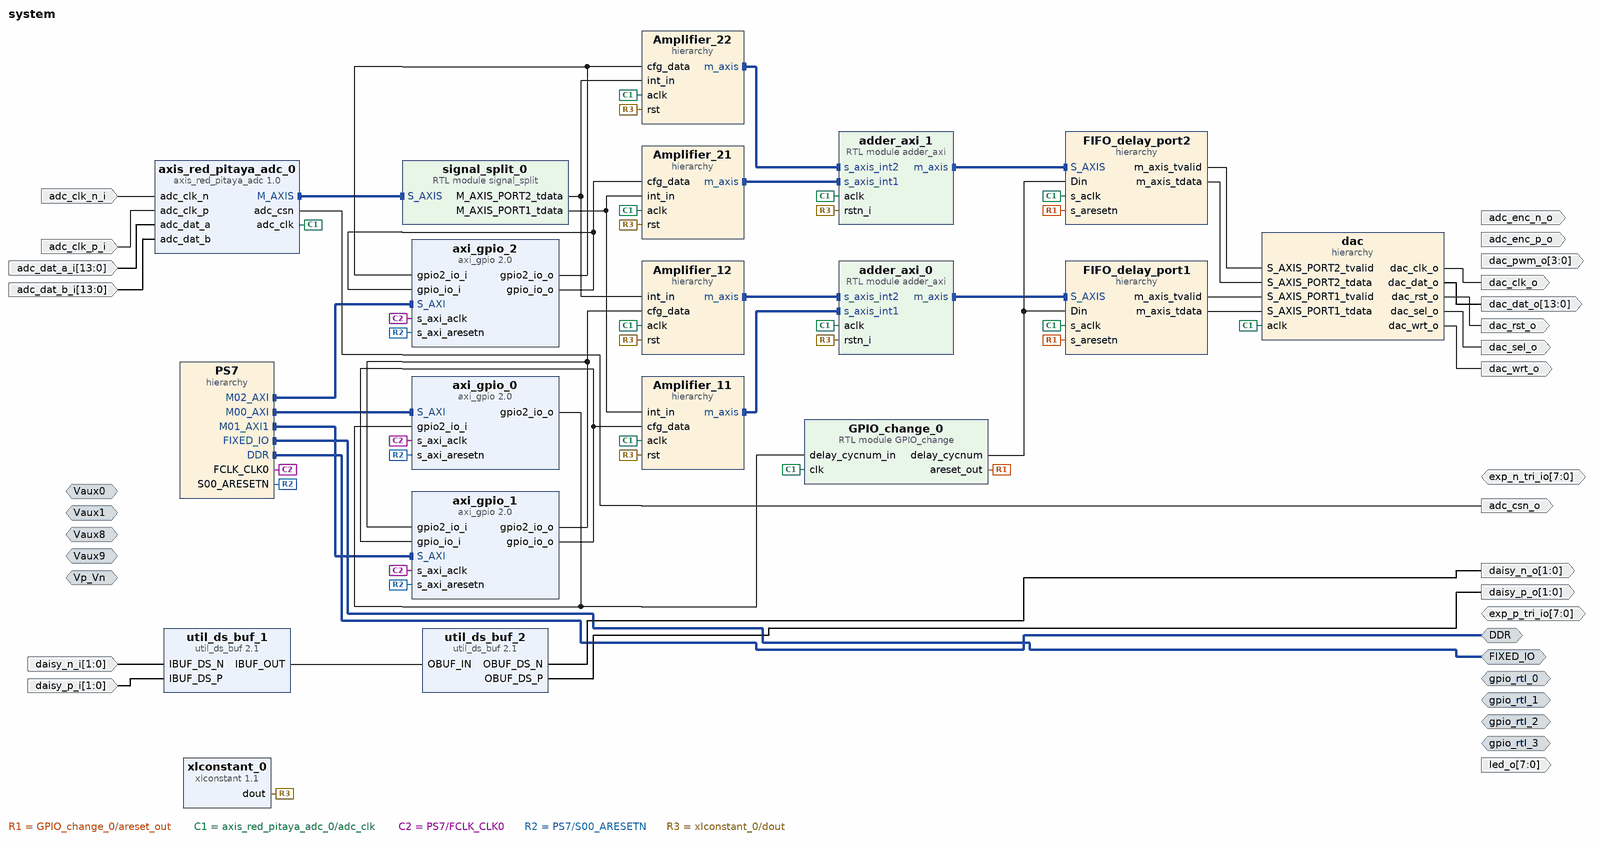
[diagram p0: block diagram of the top level]
# Vivado block design system, xc7z010clg400-1, Vivado 2020.1
create_bd_design system

create_bd_intf_port -mode Master -vlnv xilinx.com:interface:ddrx_rtl:1.0 DDR
create_bd_intf_port -mode Master -vlnv xilinx.com:display_processing_system7:fixedio_rtl:1.0 FIXED_IO
create_bd_intf_port -mode Slave -vlnv xilinx.com:interface:diff_analog_io_rtl:1.0 Vaux0
create_bd_intf_port -mode Slave -vlnv xilinx.com:interface:diff_analog_io_rtl:1.0 Vaux1
create_bd_intf_port -mode Slave -vlnv xilinx.com:interface:diff_analog_io_rtl:1.0 Vaux8
create_bd_intf_port -mode Slave -vlnv xilinx.com:interface:diff_analog_io_rtl:1.0 Vaux9
create_bd_intf_port -mode Slave -vlnv xilinx.com:interface:diff_analog_io_rtl:1.0 Vp_Vn
create_bd_intf_port -mode Master -vlnv xilinx.com:interface:gpio_rtl:1.0 gpio_rtl_0
create_bd_intf_port -mode Master -vlnv xilinx.com:interface:gpio_rtl:1.0 gpio_rtl_1
create_bd_intf_port -mode Master -vlnv xilinx.com:interface:gpio_rtl:1.0 gpio_rtl_2
create_bd_intf_port -mode Master -vlnv xilinx.com:interface:gpio_rtl:1.0 gpio_rtl_3
create_bd_port -dir I adc_clk_n_i
create_bd_port -dir I adc_clk_p_i
create_bd_port -dir O adc_csn_o
create_bd_port -dir I -from 13 -to 0 adc_dat_a_i
create_bd_port -dir I -from 13 -to 0 adc_dat_b_i
create_bd_port -dir O adc_enc_n_o
create_bd_port -dir O adc_enc_p_o
create_bd_port -dir O dac_clk_o
create_bd_port -dir O -from 13 -to 0 dac_dat_o
create_bd_port -dir O -from 3 -to 0 dac_pwm_o
create_bd_port -dir O dac_rst_o
create_bd_port -dir O dac_sel_o
create_bd_port -dir O dac_wrt_o
create_bd_port -dir I -from 1 -to 0 daisy_n_i
create_bd_port -dir O -from 1 -to 0 daisy_n_o
create_bd_port -dir I -from 1 -to 0 daisy_p_i
create_bd_port -dir O -from 1 -to 0 daisy_p_o
create_bd_port -dir IO -from 7 -to 0 exp_n_tri_io
create_bd_port -dir IO -from 7 -to 0 exp_p_tri_io
create_bd_port -dir O -from 7 -to 0 led_o

create_bd_cell -type hier FIFO_delay_port1
create_bd_cell -type hier FIFO_delay_port2
create_bd_cell -type module -reference GPIO_change GPIO_change_0
create_bd_cell -type hier PS7
create_bd_cell -type hier dac
create_bd_cell -type ip -vlnv xilinx.com:ip:util_ds_buf:2.1 util_ds_buf_1
set_property -dict {CONFIG.C_SIZE 2} [get_bd_cells util_ds_buf_1]
create_bd_cell -type ip -vlnv xilinx.com:ip:util_ds_buf:2.1 util_ds_buf_2
set_property -dict {CONFIG.C_BUF_TYPE OBUFDS CONFIG.C_SIZE 2} [get_bd_cells util_ds_buf_2]
create_bd_cell -type ip -vlnv pavel-demin:user:axis_red_pitaya_adc:1.0 axis_red_pitaya_adc_0
create_bd_cell -type module -reference signal_split signal_split_0
create_bd_cell -type hier Amplifier_11
create_bd_cell -type module -reference adder_axi adder_axi_0
create_bd_cell -type ip -vlnv xilinx.com:ip:xlconstant:1.1 xlconstant_0
create_bd_cell -type module -reference adder_axi adder_axi_1
create_bd_cell -type hier Amplifier_12
create_bd_cell -type hier Amplifier_21
create_bd_cell -type hier Amplifier_22
create_bd_cell -type ip -vlnv xilinx.com:ip:axi_gpio:2.0 axi_gpio_0
set_property -dict {CONFIG.C_ALL_INPUTS 1 CONFIG.C_ALL_INPUTS_2 0 CONFIG.C_IS_DUAL 1} [get_bd_cells axi_gpio_0]
create_bd_cell -type ip -vlnv xilinx.com:ip:axi_gpio:2.0 axi_gpio_1
set_property -dict {CONFIG.C_ALL_INPUTS 0 CONFIG.C_ALL_INPUTS_2 0 CONFIG.C_IS_DUAL 1} [get_bd_cells axi_gpio_1]
create_bd_cell -type ip -vlnv xilinx.com:ip:axi_gpio:2.0 axi_gpio_2
set_property -dict {CONFIG.C_ALL_INPUTS 0 CONFIG.C_ALL_INPUTS_2 0 CONFIG.C_IS_DUAL 1} [get_bd_cells axi_gpio_2]

# ---- hierarchy /FIFO_delay_port1 ----
current_bd_instance /FIFO_delay_port1
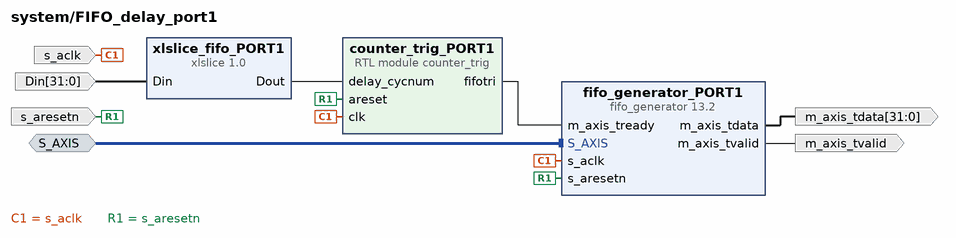
[diagram p1: block diagram inside /FIFO_delay_port1]
create_bd_intf_pin -mode Slave -vlnv xilinx.com:interface:axis_rtl:1.0 S_AXIS
create_bd_pin -dir I -from 31 -to 0 Din
create_bd_pin -dir O -from 31 -to 0 m_axis_tdata
create_bd_pin -dir O m_axis_tvalid
create_bd_pin -dir I -type clk s_aclk
create_bd_pin -dir I -type rst s_aresetn

create_bd_cell -type module -reference counter_trig counter_trig_PORT1
create_bd_cell -type ip -vlnv xilinx.com:ip:fifo_generator:13.2 fifo_generator_PORT1
set_property -dict [list \
  CONFIG.Clock_Type_AXI Common_Clock \
  CONFIG.Enable_Safety_Circuit true \
  CONFIG.FIFO_Implementation_rach Common_Clock_Distributed_RAM \
  CONFIG.FIFO_Implementation_wach Common_Clock_Distributed_RAM \
  CONFIG.FIFO_Implementation_wrch Common_Clock_Distributed_RAM \
  CONFIG.Full_Flags_Reset_Value 1 \
  CONFIG.INTERFACE_TYPE AXI_STREAM \
  CONFIG.Input_Depth_axis 16384 \
  CONFIG.TDATA_NUM_BYTES 4 \
  CONFIG.TUSER_WIDTH 0 \
] [get_bd_cells fifo_generator_PORT1]
create_bd_cell -type ip -vlnv xilinx.com:ip:xlslice:1.0 xlslice_fifo_PORT1
set_property -dict {CONFIG.DIN_FROM 15 CONFIG.DIN_TO 0 CONFIG.DOUT_WIDTH 16} [get_bd_cells xlslice_fifo_PORT1]

# ---- hierarchy /FIFO_delay_port2 ----
current_bd_instance /FIFO_delay_port2
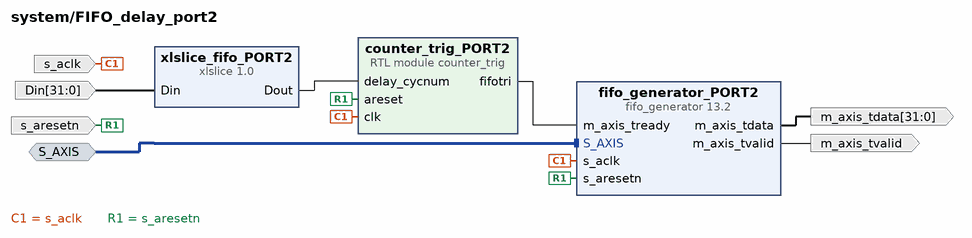
[diagram p2: block diagram inside /FIFO_delay_port2]
create_bd_intf_pin -mode Slave -vlnv xilinx.com:interface:axis_rtl:1.0 S_AXIS
create_bd_pin -dir I -from 31 -to 0 Din
create_bd_pin -dir O -from 31 -to 0 m_axis_tdata
create_bd_pin -dir O m_axis_tvalid
create_bd_pin -dir I -type clk s_aclk
create_bd_pin -dir I -type rst s_aresetn

create_bd_cell -type module -reference counter_trig counter_trig_PORT2
create_bd_cell -type ip -vlnv xilinx.com:ip:fifo_generator:13.2 fifo_generator_PORT2
set_property -dict [list \
  CONFIG.Enable_Safety_Circuit true \
  CONFIG.FIFO_Implementation_rach Common_Clock_Distributed_RAM \
  CONFIG.FIFO_Implementation_wach Common_Clock_Distributed_RAM \
  CONFIG.FIFO_Implementation_wrch Common_Clock_Distributed_RAM \
  CONFIG.Full_Flags_Reset_Value 1 \
  CONFIG.INTERFACE_TYPE AXI_STREAM \
  CONFIG.Input_Depth_axis 16384 \
  CONFIG.TDATA_NUM_BYTES 4 \
  CONFIG.TUSER_WIDTH 0 \
] [get_bd_cells fifo_generator_PORT2]
create_bd_cell -type ip -vlnv xilinx.com:ip:xlslice:1.0 xlslice_fifo_PORT2
set_property -dict {CONFIG.DIN_FROM 31 CONFIG.DIN_TO 16 CONFIG.DOUT_WIDTH 16} [get_bd_cells xlslice_fifo_PORT2]

# ---- hierarchy /PS7 ----
current_bd_instance /PS7
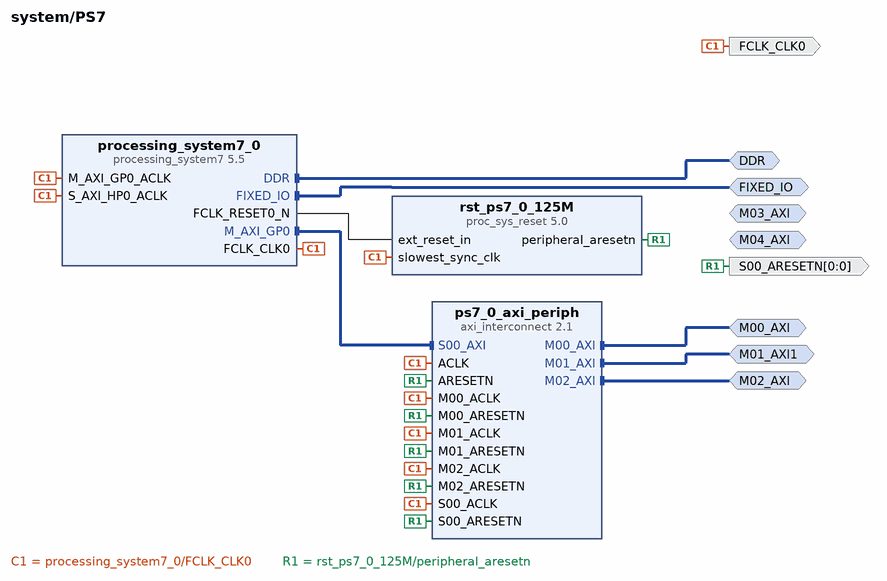
[diagram p3: block diagram inside /PS7]
create_bd_intf_pin -mode Master -vlnv xilinx.com:interface:ddrx_rtl:1.0 DDR
create_bd_intf_pin -mode Master -vlnv xilinx.com:display_processing_system7:fixedio_rtl:1.0 FIXED_IO
create_bd_intf_pin -mode Master -vlnv xilinx.com:interface:aximm_rtl:1.0 M00_AXI
create_bd_intf_pin -mode Master -vlnv xilinx.com:interface:aximm_rtl:1.0 M01_AXI1
create_bd_intf_pin -mode Master -vlnv xilinx.com:interface:aximm_rtl:1.0 M02_AXI
create_bd_intf_pin -mode Master -vlnv xilinx.com:interface:aximm_rtl:1.0 M03_AXI
create_bd_intf_pin -mode Master -vlnv xilinx.com:interface:aximm_rtl:1.0 M04_AXI
create_bd_pin -dir O -type clk FCLK_CLK0
create_bd_pin -dir O -from 0 -to 0 -type rst S00_ARESETN

create_bd_cell -type ip -vlnv xilinx.com:ip:processing_system7:5.5 processing_system7_0
set_property -dict [list \
  CONFIG.PCW_APU_PERIPHERAL_FREQMHZ 666.666666 \
  CONFIG.PCW_ENET0_ENET0_IO {MIO 16 .. 27} \
  CONFIG.PCW_ENET0_GRP_MDIO_ENABLE 1 \
  CONFIG.PCW_ENET0_GRP_MDIO_IO EMIO \
  CONFIG.PCW_ENET0_PERIPHERAL_ENABLE 1 \
  CONFIG.PCW_ENET0_RESET_ENABLE 0 \
  CONFIG.PCW_ENET_RESET_ENABLE 1 \
  CONFIG.PCW_ENET_RESET_SELECT {Share reset pin} \
  CONFIG.PCW_FPGA0_PERIPHERAL_FREQMHZ 125 \
  CONFIG.PCW_FPGA1_PERIPHERAL_FREQMHZ 250 \
  CONFIG.PCW_FPGA3_PERIPHERAL_FREQMHZ 200 \
  CONFIG.PCW_GPIO_MIO_GPIO_ENABLE 1 \
  CONFIG.PCW_GPIO_MIO_GPIO_IO MIO \
  CONFIG.PCW_GPIO_PERIPHERAL_ENABLE 1 \
  CONFIG.PCW_I2C0_GRP_INT_ENABLE 0 \
  CONFIG.PCW_I2C0_I2C0_IO {MIO 50 .. 51} \
  CONFIG.PCW_I2C0_PERIPHERAL_ENABLE 1 \
  CONFIG.PCW_I2C_PERIPHERAL_FREQMHZ 111.111115 \
  CONFIG.PCW_I2C_RESET_ENABLE 1 \
  CONFIG.PCW_I2C_RESET_SELECT {Share reset pin} \
  CONFIG.PCW_IMPORT_BOARD_PRESET cfg/red_pitaya.xml \
  CONFIG.PCW_PRESET_BANK1_VOLTAGE {LVCMOS 2.5V} \
  CONFIG.PCW_QSPI_GRP_SINGLE_SS_ENABLE 1 \
  CONFIG.PCW_QSPI_GRP_SINGLE_SS_IO {MIO 1 .. 6} \
  CONFIG.PCW_QSPI_PERIPHERAL_ENABLE 1 \
  CONFIG.PCW_QSPI_PERIPHERAL_FREQMHZ 125 \
  CONFIG.PCW_QSPI_QSPI_IO {MIO 1 .. 6} \
  CONFIG.PCW_SD0_GRP_CD_ENABLE 1 \
  CONFIG.PCW_SD0_GRP_CD_IO {MIO 46} \
  CONFIG.PCW_SD0_GRP_WP_ENABLE 1 \
  CONFIG.PCW_SD0_GRP_WP_IO {MIO 47} \
  CONFIG.PCW_SD0_PERIPHERAL_ENABLE 1 \
  CONFIG.PCW_SD0_SD0_IO {MIO 40 .. 45} \
  CONFIG.PCW_SDIO_PERIPHERAL_FREQMHZ 100 \
  CONFIG.PCW_SINGLE_QSPI_DATA_MODE x4 \
  CONFIG.PCW_SPI0_PERIPHERAL_ENABLE 1 \
  CONFIG.PCW_SPI0_SPI0_IO EMIO \
  CONFIG.PCW_SPI1_PERIPHERAL_ENABLE 1 \
  CONFIG.PCW_SPI1_SPI1_IO {MIO 10 .. 15} \
  CONFIG.PCW_TTC0_PERIPHERAL_ENABLE 1 \
  CONFIG.PCW_TTC0_TTC0_IO EMIO \
  CONFIG.PCW_UART0_PERIPHERAL_ENABLE 1 \
  CONFIG.PCW_UART0_UART0_IO {MIO 14 .. 15} \
  CONFIG.PCW_UART1_PERIPHERAL_ENABLE 1 \
  CONFIG.PCW_UART1_UART1_IO {MIO 8 .. 9} \
  CONFIG.PCW_UART_PERIPHERAL_FREQMHZ 100 \
  CONFIG.PCW_UIPARAM_DDR_BUS_WIDTH {16 Bit} \
  CONFIG.PCW_UIPARAM_DDR_FREQ_MHZ 533.333333 \
  CONFIG.PCW_UIPARAM_DDR_PARTNO {MT41J256M16 RE-125} \
  CONFIG.PCW_USB0_PERIPHERAL_ENABLE 1 \
  CONFIG.PCW_USB0_RESET_ENABLE 1 \
  CONFIG.PCW_USB0_RESET_IO {MIO 48} \
  CONFIG.PCW_USB0_USB0_IO {MIO 28 .. 39} \
  CONFIG.PCW_USB_RESET_ENABLE 1 \
  CONFIG.PCW_USB_RESET_SELECT {Share reset pin} \
  CONFIG.PCW_USE_S_AXI_HP0 1 \
] [get_bd_cells processing_system7_0]
# 429 more settings of processing_system7_0 are not shown: defaults, MIO pin electricals, DDR timing, and values the tool derives
create_bd_cell -type ip -vlnv xilinx.com:ip:axi_interconnect:2.1 ps7_0_axi_periph
set_property -dict {CONFIG.NUM_MI 3 CONFIG.NUM_SI 1 CONFIG.S00_HAS_DATA_FIFO 2 CONFIG.STRATEGY 0} [get_bd_cells ps7_0_axi_periph]
create_bd_cell -type ip -vlnv xilinx.com:ip:proc_sys_reset:5.0 rst_ps7_0_125M

# ---- hierarchy /dac ----
current_bd_instance /dac
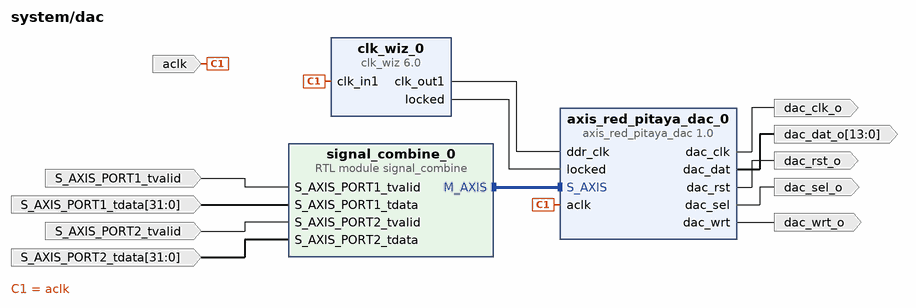
[diagram p4: block diagram inside /dac]
create_bd_pin -dir I -type clk aclk
create_bd_pin -dir O -type clk dac_clk_o
create_bd_pin -dir O -from 13 -to 0 dac_dat_o
create_bd_pin -dir O -type rst dac_rst_o
create_bd_pin -dir O dac_sel_o
create_bd_pin -dir O dac_wrt_o
create_bd_pin -dir I S_AXIS_PORT1_tvalid
create_bd_pin -dir I -from 31 -to 0 S_AXIS_PORT1_tdata
create_bd_pin -dir I S_AXIS_PORT2_tvalid
create_bd_pin -dir I -from 31 -to 0 S_AXIS_PORT2_tdata

create_bd_cell -type ip -vlnv pavel-demin:user:axis_red_pitaya_dac:1.0 axis_red_pitaya_dac_0
create_bd_cell -type ip -vlnv xilinx.com:ip:clk_wiz:6.0 clk_wiz_0
set_property -dict [list \
  CONFIG.CLKIN1_JITTER_PS 80.0 \
  CONFIG.CLKOUT1_JITTER 104.759 \
  CONFIG.CLKOUT1_PHASE_ERROR 96.948 \
  CONFIG.CLKOUT1_REQUESTED_OUT_FREQ 250.000 \
  CONFIG.MMCM_CLKFBOUT_MULT_F 8.000 \
  CONFIG.MMCM_CLKIN1_PERIOD 8.000 \
  CONFIG.MMCM_CLKOUT0_DIVIDE_F 4.000 \
  CONFIG.MMCM_DIVCLK_DIVIDE 1 \
  CONFIG.PRIM_IN_FREQ 125.000 \
  CONFIG.USE_RESET false \
] [get_bd_cells clk_wiz_0]
create_bd_cell -type module -reference signal_combine signal_combine_0

# ---- hierarchy /Amplifier_11 ----
current_bd_instance /Amplifier_11
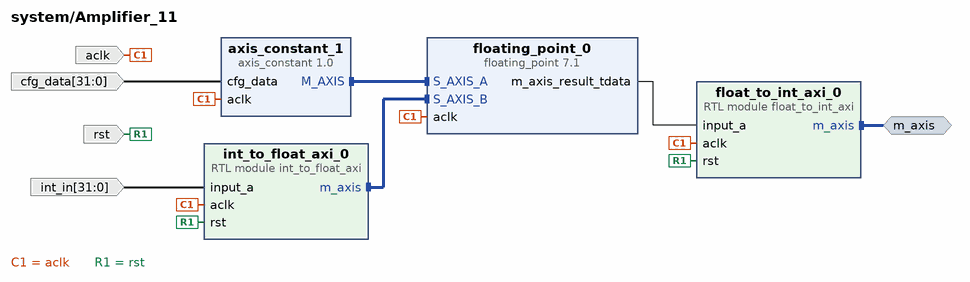
[diagram p5: block diagram inside /Amplifier_11]
create_bd_intf_pin -mode Master -vlnv xilinx.com:interface:axis_rtl:1.0 m_axis
create_bd_pin -dir I -type clk aclk
create_bd_pin -dir I -from 31 -to 0 cfg_data
create_bd_pin -dir I -from 31 -to 0 int_in
create_bd_pin -dir I -type rst rst

create_bd_cell -type ip -vlnv pavel-demin:user:axis_constant:1.0 axis_constant_1
create_bd_cell -type ip -vlnv xilinx.com:ip:floating_point:7.1 floating_point_0
set_property -dict [list \
  CONFIG.C_Latency 8 \
  CONFIG.C_Mult_Usage Full_Usage \
  CONFIG.C_Rate 1 \
  CONFIG.C_Result_Exponent_Width 8 \
  CONFIG.C_Result_Fraction_Width 24 \
  CONFIG.Flow_Control NonBlocking \
  CONFIG.Has_RESULT_TREADY false \
  CONFIG.Operation_Type Multiply \
  CONFIG.Result_Precision_Type Single \
] [get_bd_cells floating_point_0]
create_bd_cell -type module -reference float_to_int_axi float_to_int_axi_0
create_bd_cell -type module -reference int_to_float_axi int_to_float_axi_0

# ---- hierarchy /Amplifier_12 ----
current_bd_instance /Amplifier_12
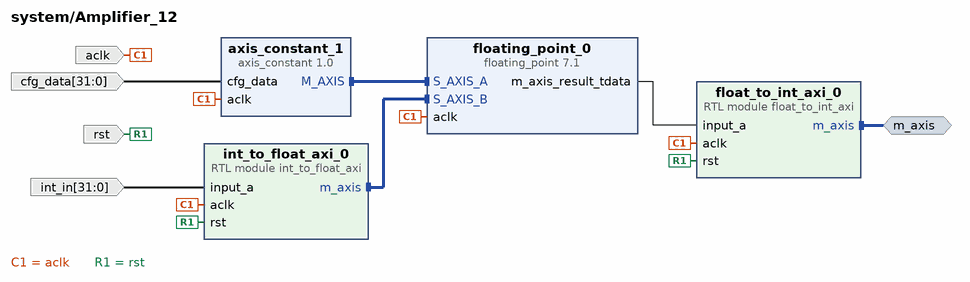
[diagram p6: block diagram inside /Amplifier_12]
create_bd_intf_pin -mode Master -vlnv xilinx.com:interface:axis_rtl:1.0 m_axis
create_bd_pin -dir I -type clk aclk
create_bd_pin -dir I -from 31 -to 0 cfg_data
create_bd_pin -dir I -from 31 -to 0 int_in
create_bd_pin -dir I -type rst rst

create_bd_cell -type ip -vlnv pavel-demin:user:axis_constant:1.0 axis_constant_1
create_bd_cell -type ip -vlnv xilinx.com:ip:floating_point:7.1 floating_point_0
set_property -dict [list \
  CONFIG.C_Latency 8 \
  CONFIG.C_Mult_Usage Full_Usage \
  CONFIG.C_Rate 1 \
  CONFIG.C_Result_Exponent_Width 8 \
  CONFIG.C_Result_Fraction_Width 24 \
  CONFIG.Flow_Control NonBlocking \
  CONFIG.Has_RESULT_TREADY false \
  CONFIG.Operation_Type Multiply \
  CONFIG.Result_Precision_Type Single \
] [get_bd_cells floating_point_0]
create_bd_cell -type module -reference float_to_int_axi float_to_int_axi_0
create_bd_cell -type module -reference int_to_float_axi int_to_float_axi_0

# ---- hierarchy /Amplifier_21 ----
current_bd_instance /Amplifier_21
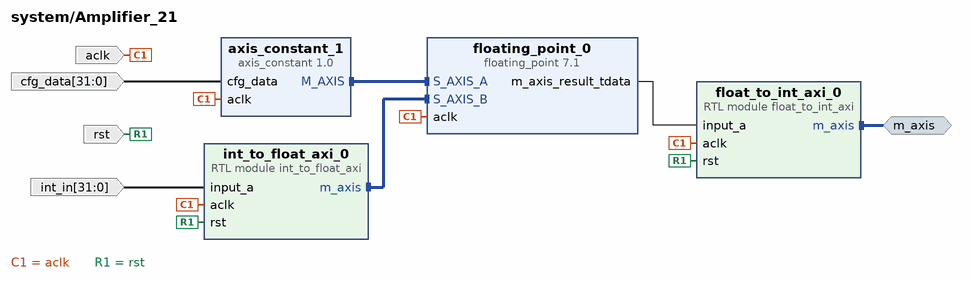
[diagram p7: block diagram inside /Amplifier_21]
create_bd_intf_pin -mode Master -vlnv xilinx.com:interface:axis_rtl:1.0 m_axis
create_bd_pin -dir I -type clk aclk
create_bd_pin -dir I -from 31 -to 0 cfg_data
create_bd_pin -dir I -from 31 -to 0 int_in
create_bd_pin -dir I -type rst rst

create_bd_cell -type ip -vlnv pavel-demin:user:axis_constant:1.0 axis_constant_1
create_bd_cell -type ip -vlnv xilinx.com:ip:floating_point:7.1 floating_point_0
set_property -dict [list \
  CONFIG.C_Latency 8 \
  CONFIG.C_Mult_Usage Full_Usage \
  CONFIG.C_Rate 1 \
  CONFIG.C_Result_Exponent_Width 8 \
  CONFIG.C_Result_Fraction_Width 24 \
  CONFIG.Flow_Control NonBlocking \
  CONFIG.Has_RESULT_TREADY false \
  CONFIG.Operation_Type Multiply \
  CONFIG.Result_Precision_Type Single \
] [get_bd_cells floating_point_0]
create_bd_cell -type module -reference float_to_int_axi float_to_int_axi_0
create_bd_cell -type module -reference int_to_float_axi int_to_float_axi_0

# ---- hierarchy /Amplifier_22 ----
current_bd_instance /Amplifier_22
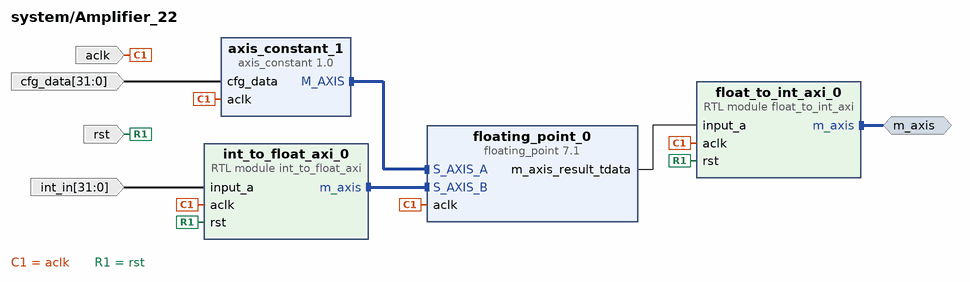
[diagram p8: block diagram inside /Amplifier_22]
create_bd_intf_pin -mode Master -vlnv xilinx.com:interface:axis_rtl:1.0 m_axis
create_bd_pin -dir I -type clk aclk
create_bd_pin -dir I -from 31 -to 0 cfg_data
create_bd_pin -dir I -from 31 -to 0 int_in
create_bd_pin -dir I -type rst rst

create_bd_cell -type ip -vlnv pavel-demin:user:axis_constant:1.0 axis_constant_1
create_bd_cell -type ip -vlnv xilinx.com:ip:floating_point:7.1 floating_point_0
set_property -dict [list \
  CONFIG.C_Latency 8 \
  CONFIG.C_Mult_Usage Full_Usage \
  CONFIG.C_Rate 1 \
  CONFIG.C_Result_Exponent_Width 8 \
  CONFIG.C_Result_Fraction_Width 24 \
  CONFIG.Flow_Control NonBlocking \
  CONFIG.Has_RESULT_TREADY false \
  CONFIG.Operation_Type Multiply \
  CONFIG.Result_Precision_Type Single \
] [get_bd_cells floating_point_0]
create_bd_cell -type module -reference float_to_int_axi float_to_int_axi_0
create_bd_cell -type module -reference int_to_float_axi int_to_float_axi_0

# ---- connections ----

current_bd_instance /FIFO_delay_port1
connect_bd_intf_net [get_bd_intf_pins S_AXIS] [get_bd_intf_pins fifo_generator_PORT1/S_AXIS]
connect_bd_net [get_bd_pins Din] [get_bd_pins xlslice_fifo_PORT1/Din]
connect_bd_net [get_bd_pins counter_trig_PORT1/fifotri] [get_bd_pins fifo_generator_PORT1/m_axis_tready]
connect_bd_net [get_bd_pins fifo_generator_PORT1/m_axis_tdata] [get_bd_pins m_axis_tdata]
connect_bd_net [get_bd_pins fifo_generator_PORT1/m_axis_tvalid] [get_bd_pins m_axis_tvalid]
connect_bd_net [get_bd_pins s_aclk] [get_bd_pins counter_trig_PORT1/clk] [get_bd_pins fifo_generator_PORT1/s_aclk]
connect_bd_net [get_bd_pins s_aresetn] [get_bd_pins counter_trig_PORT1/areset] [get_bd_pins fifo_generator_PORT1/s_aresetn]
connect_bd_net [get_bd_pins xlslice_fifo_PORT1/Dout] [get_bd_pins counter_trig_PORT1/delay_cycnum]

current_bd_instance /FIFO_delay_port2
connect_bd_intf_net -intf_net signal_split_0_M_AXIS_PORT2 [get_bd_intf_pins S_AXIS] [get_bd_intf_pins fifo_generator_PORT2/S_AXIS]
connect_bd_net [get_bd_pins Din] [get_bd_pins xlslice_fifo_PORT2/Din]
connect_bd_net -net axis_red_pitaya_adc_0_adc_clk [get_bd_pins s_aclk] [get_bd_pins counter_trig_PORT2/clk] [get_bd_pins fifo_generator_PORT2/s_aclk]
connect_bd_net -net counter_trig_0_fifotri [get_bd_pins counter_trig_PORT2/fifotri] [get_bd_pins fifo_generator_PORT2/m_axis_tready]
connect_bd_net -net delay_sync_0_areset_out [get_bd_pins s_aresetn] \
  [get_bd_pins counter_trig_PORT2/areset] [get_bd_pins fifo_generator_PORT2/s_aresetn]
connect_bd_net -net fifo_generator_0_m_axis_tdata [get_bd_pins fifo_generator_PORT2/m_axis_tdata] [get_bd_pins m_axis_tdata]
connect_bd_net -net fifo_generator_0_m_axis_tvalid [get_bd_pins fifo_generator_PORT2/m_axis_tvalid] [get_bd_pins m_axis_tvalid]
connect_bd_net [get_bd_pins xlslice_fifo_PORT2/Dout] [get_bd_pins counter_trig_PORT2/delay_cycnum]

current_bd_instance /PS7
connect_bd_intf_net [get_bd_intf_pins M01_AXI1] [get_bd_intf_pins ps7_0_axi_periph/M01_AXI]
connect_bd_intf_net [get_bd_intf_pins M00_AXI] [get_bd_intf_pins ps7_0_axi_periph/M00_AXI]
connect_bd_intf_net [get_bd_intf_pins M02_AXI] [get_bd_intf_pins ps7_0_axi_periph/M02_AXI]
connect_bd_intf_net [get_bd_intf_pins FIXED_IO] [get_bd_intf_pins processing_system7_0/FIXED_IO]
connect_bd_intf_net [get_bd_intf_pins processing_system7_0/M_AXI_GP0] [get_bd_intf_pins ps7_0_axi_periph/S00_AXI]
connect_bd_intf_net [get_bd_intf_pins DDR] [get_bd_intf_pins processing_system7_0/DDR]
connect_bd_net [get_bd_pins processing_system7_0/FCLK_CLK0] \
  [get_bd_pins FCLK_CLK0] [get_bd_pins processing_system7_0/M_AXI_GP0_ACLK] [get_bd_pins processing_system7_0/S_AXI_HP0_ACLK] \
  [get_bd_pins ps7_0_axi_periph/ACLK] [get_bd_pins ps7_0_axi_periph/M00_ACLK] [get_bd_pins ps7_0_axi_periph/M01_ACLK] \
  [get_bd_pins ps7_0_axi_periph/S00_ACLK] [get_bd_pins rst_ps7_0_125M/slowest_sync_clk] \
  [get_bd_pins ps7_0_axi_periph/M02_ACLK]
connect_bd_net [get_bd_pins processing_system7_0/FCLK_RESET0_N] [get_bd_pins rst_ps7_0_125M/ext_reset_in]
connect_bd_net [get_bd_pins rst_ps7_0_125M/peripheral_aresetn] \
  [get_bd_pins S00_ARESETN] [get_bd_pins ps7_0_axi_periph/ARESETN] [get_bd_pins ps7_0_axi_periph/M00_ARESETN] \
  [get_bd_pins ps7_0_axi_periph/M01_ARESETN] [get_bd_pins ps7_0_axi_periph/S00_ARESETN] \
  [get_bd_pins ps7_0_axi_periph/M02_ARESETN]

current_bd_instance /dac
connect_bd_intf_net [get_bd_intf_pins axis_red_pitaya_dac_0/S_AXIS] [get_bd_intf_pins signal_combine_0/M_AXIS]
connect_bd_net -net axis_red_pitaya_adc_0_adc_clk [get_bd_pins aclk] [get_bd_pins axis_red_pitaya_dac_0/aclk] [get_bd_pins clk_wiz_0/clk_in1]
connect_bd_net [get_bd_pins axis_red_pitaya_dac_0/dac_clk] [get_bd_pins dac_clk_o]
connect_bd_net [get_bd_pins axis_red_pitaya_dac_0/dac_dat] [get_bd_pins dac_dat_o]
connect_bd_net [get_bd_pins axis_red_pitaya_dac_0/dac_rst] [get_bd_pins dac_rst_o]
connect_bd_net [get_bd_pins axis_red_pitaya_dac_0/dac_sel] [get_bd_pins dac_sel_o]
connect_bd_net [get_bd_pins axis_red_pitaya_dac_0/dac_wrt] [get_bd_pins dac_wrt_o]
connect_bd_net [get_bd_pins clk_wiz_0/clk_out1] [get_bd_pins axis_red_pitaya_dac_0/ddr_clk]
connect_bd_net [get_bd_pins clk_wiz_0/locked] [get_bd_pins axis_red_pitaya_dac_0/locked]
connect_bd_net [get_bd_pins S_AXIS_PORT1_tvalid] [get_bd_pins signal_combine_0/S_AXIS_PORT1_tvalid]
connect_bd_net [get_bd_pins S_AXIS_PORT1_tdata] [get_bd_pins signal_combine_0/S_AXIS_PORT1_tdata]
connect_bd_net [get_bd_pins S_AXIS_PORT2_tvalid] [get_bd_pins signal_combine_0/S_AXIS_PORT2_tvalid]
connect_bd_net [get_bd_pins S_AXIS_PORT2_tdata] [get_bd_pins signal_combine_0/S_AXIS_PORT2_tdata]

current_bd_instance /Amplifier_11
connect_bd_intf_net [get_bd_intf_pins axis_constant_1/M_AXIS] [get_bd_intf_pins floating_point_0/S_AXIS_A]
connect_bd_intf_net [get_bd_intf_pins m_axis] [get_bd_intf_pins float_to_int_axi_0/m_axis]
connect_bd_intf_net [get_bd_intf_pins int_to_float_axi_0/m_axis] [get_bd_intf_pins floating_point_0/S_AXIS_B]
connect_bd_net -net axis_red_pitaya_adc_0_adc_clk [get_bd_pins aclk] \
  [get_bd_pins floating_point_0/aclk] [get_bd_pins axis_constant_1/aclk] [get_bd_pins float_to_int_axi_0/aclk] \
  [get_bd_pins int_to_float_axi_0/aclk]
connect_bd_net -net axi_gpio_1_gpio2_io_o [get_bd_pins cfg_data] [get_bd_pins axis_constant_1/cfg_data]
connect_bd_net -net signal_split_0_M_AXIS_PORT1_tdata [get_bd_pins int_in] [get_bd_pins int_to_float_axi_0/input_a]
connect_bd_net [get_bd_pins floating_point_0/m_axis_result_tdata] [get_bd_pins float_to_int_axi_0/input_a]
connect_bd_net [get_bd_pins rst] [get_bd_pins int_to_float_axi_0/rst] [get_bd_pins float_to_int_axi_0/rst]

current_bd_instance /Amplifier_12
connect_bd_intf_net [get_bd_intf_pins axis_constant_1/M_AXIS] [get_bd_intf_pins floating_point_0/S_AXIS_A]
connect_bd_intf_net [get_bd_intf_pins int_to_float_axi_0/m_axis] [get_bd_intf_pins floating_point_0/S_AXIS_B]
connect_bd_intf_net [get_bd_intf_pins m_axis] [get_bd_intf_pins float_to_int_axi_0/m_axis]
connect_bd_net -net axis_red_pitaya_adc_0_adc_clk [get_bd_pins aclk] \
  [get_bd_pins floating_point_0/aclk] [get_bd_pins axis_constant_1/aclk] [get_bd_pins float_to_int_axi_0/aclk] \
  [get_bd_pins int_to_float_axi_0/aclk]
connect_bd_net -net axi_gpio_1_gpio2_io_o [get_bd_pins cfg_data] [get_bd_pins axis_constant_1/cfg_data]
connect_bd_net -net signal_split_0_M_AXIS_PORT1_tdata [get_bd_pins int_in] [get_bd_pins int_to_float_axi_0/input_a]
connect_bd_net [get_bd_pins floating_point_0/m_axis_result_tdata] [get_bd_pins float_to_int_axi_0/input_a]
connect_bd_net [get_bd_pins rst] [get_bd_pins int_to_float_axi_0/rst] [get_bd_pins float_to_int_axi_0/rst]

current_bd_instance /Amplifier_21
connect_bd_intf_net [get_bd_intf_pins m_axis] [get_bd_intf_pins float_to_int_axi_0/m_axis]
connect_bd_intf_net [get_bd_intf_pins axis_constant_1/M_AXIS] [get_bd_intf_pins floating_point_0/S_AXIS_A]
connect_bd_intf_net [get_bd_intf_pins int_to_float_axi_0/m_axis] [get_bd_intf_pins floating_point_0/S_AXIS_B]
connect_bd_net -net axis_red_pitaya_adc_0_adc_clk [get_bd_pins aclk] \
  [get_bd_pins floating_point_0/aclk] [get_bd_pins axis_constant_1/aclk] [get_bd_pins float_to_int_axi_0/aclk] \
  [get_bd_pins int_to_float_axi_0/aclk]
connect_bd_net -net axi_gpio_1_gpio2_io_o [get_bd_pins cfg_data] [get_bd_pins axis_constant_1/cfg_data]
connect_bd_net -net signal_split_0_M_AXIS_PORT1_tdata [get_bd_pins int_in] [get_bd_pins int_to_float_axi_0/input_a]
connect_bd_net [get_bd_pins floating_point_0/m_axis_result_tdata] [get_bd_pins float_to_int_axi_0/input_a]
connect_bd_net [get_bd_pins rst] [get_bd_pins int_to_float_axi_0/rst] [get_bd_pins float_to_int_axi_0/rst]

current_bd_instance /Amplifier_22
connect_bd_intf_net [get_bd_intf_pins int_to_float_axi_0/m_axis] [get_bd_intf_pins floating_point_0/S_AXIS_B]
connect_bd_intf_net [get_bd_intf_pins m_axis] [get_bd_intf_pins float_to_int_axi_0/m_axis]
connect_bd_intf_net [get_bd_intf_pins axis_constant_1/M_AXIS] [get_bd_intf_pins floating_point_0/S_AXIS_A]
connect_bd_net -net axis_red_pitaya_adc_0_adc_clk [get_bd_pins aclk] \
  [get_bd_pins floating_point_0/aclk] [get_bd_pins axis_constant_1/aclk] [get_bd_pins float_to_int_axi_0/aclk] \
  [get_bd_pins int_to_float_axi_0/aclk]
connect_bd_net -net axi_gpio_1_gpio2_io_o [get_bd_pins cfg_data] [get_bd_pins axis_constant_1/cfg_data]
connect_bd_net -net signal_split_0_M_AXIS_PORT1_tdata [get_bd_pins int_in] [get_bd_pins int_to_float_axi_0/input_a]
connect_bd_net [get_bd_pins floating_point_0/m_axis_result_tdata] [get_bd_pins float_to_int_axi_0/input_a]
connect_bd_net [get_bd_pins rst] [get_bd_pins int_to_float_axi_0/rst] [get_bd_pins float_to_int_axi_0/rst]

current_bd_instance /
connect_bd_intf_net -intf_net processing_system7_0_FIXED_IO [get_bd_intf_ports FIXED_IO] [get_bd_intf_pins PS7/FIXED_IO]
connect_bd_intf_net [get_bd_intf_pins Amplifier_11/m_axis] [get_bd_intf_pins adder_axi_0/s_axis_int1]
connect_bd_intf_net [get_bd_intf_pins PS7/M01_AXI1] [get_bd_intf_pins axi_gpio_1/S_AXI]
connect_bd_intf_net [get_bd_intf_pins adder_axi_1/m_axis] [get_bd_intf_pins FIFO_delay_port2/S_AXIS]
connect_bd_intf_net [get_bd_intf_pins Amplifier_21/m_axis] [get_bd_intf_pins adder_axi_1/s_axis_int1]
connect_bd_intf_net [get_bd_intf_pins PS7/M02_AXI] [get_bd_intf_pins axi_gpio_2/S_AXI]
connect_bd_intf_net [get_bd_intf_pins axis_red_pitaya_adc_0/M_AXIS] [get_bd_intf_pins signal_split_0/S_AXIS]
connect_bd_intf_net [get_bd_intf_pins Amplifier_22/m_axis] [get_bd_intf_pins adder_axi_1/s_axis_int2]
connect_bd_intf_net [get_bd_intf_pins adder_axi_0/m_axis] [get_bd_intf_pins FIFO_delay_port1/S_AXIS]
connect_bd_intf_net [get_bd_intf_pins Amplifier_12/m_axis] [get_bd_intf_pins adder_axi_0/s_axis_int2]
connect_bd_intf_net -intf_net processing_system7_0_DDR [get_bd_intf_ports DDR] [get_bd_intf_pins PS7/DDR]
connect_bd_intf_net [get_bd_intf_pins PS7/M00_AXI] [get_bd_intf_pins axi_gpio_0/S_AXI]
connect_bd_net [get_bd_pins GPIO_change_0/areset_out] [get_bd_pins FIFO_delay_port1/s_aresetn] [get_bd_pins FIFO_delay_port2/s_aresetn]
connect_bd_net [get_bd_pins GPIO_change_0/delay_cycnum] [get_bd_pins FIFO_delay_port1/Din] [get_bd_pins FIFO_delay_port2/Din]
connect_bd_net [get_bd_ports adc_clk_n_i] [get_bd_pins axis_red_pitaya_adc_0/adc_clk_n]
connect_bd_net [get_bd_ports adc_clk_p_i] [get_bd_pins axis_red_pitaya_adc_0/adc_clk_p]
connect_bd_net [get_bd_ports adc_dat_a_i] [get_bd_pins axis_red_pitaya_adc_0/adc_dat_a]
connect_bd_net [get_bd_ports adc_dat_b_i] [get_bd_pins axis_red_pitaya_adc_0/adc_dat_b]
connect_bd_net [get_bd_pins axi_gpio_0/gpio2_io_o] [get_bd_pins GPIO_change_0/delay_cycnum_in] [get_bd_pins axi_gpio_0/gpio2_io_i]
connect_bd_net [get_bd_pins axis_red_pitaya_adc_0/adc_clk] \
  [get_bd_pins FIFO_delay_port1/s_aclk] [get_bd_pins FIFO_delay_port2/s_aclk] [get_bd_pins GPIO_change_0/clk] \
  [get_bd_pins dac/aclk] [get_bd_pins Amplifier_11/aclk] [get_bd_pins adder_axi_0/aclk] [get_bd_pins adder_axi_1/aclk] \
  [get_bd_pins Amplifier_12/aclk] [get_bd_pins Amplifier_21/aclk] [get_bd_pins Amplifier_22/aclk]
connect_bd_net [get_bd_pins axis_red_pitaya_adc_0/adc_csn] [get_bd_ports adc_csn_o]
connect_bd_net -net axis_red_pitaya_dac_0_dac_clk [get_bd_pins dac/dac_clk_o] [get_bd_ports dac_clk_o]
connect_bd_net -net axis_red_pitaya_dac_0_dac_dat [get_bd_pins dac/dac_dat_o] [get_bd_ports dac_dat_o]
connect_bd_net -net axis_red_pitaya_dac_0_dac_rst [get_bd_pins dac/dac_rst_o] [get_bd_ports dac_rst_o]
connect_bd_net -net axis_red_pitaya_dac_0_dac_sel [get_bd_pins dac/dac_sel_o] [get_bd_ports dac_sel_o]
connect_bd_net -net axis_red_pitaya_dac_0_dac_wrt [get_bd_pins dac/dac_wrt_o] [get_bd_ports dac_wrt_o]
connect_bd_net [get_bd_ports daisy_n_i] [get_bd_pins util_ds_buf_1/IBUF_DS_N]
connect_bd_net [get_bd_ports daisy_p_i] [get_bd_pins util_ds_buf_1/IBUF_DS_P]
connect_bd_net -net processing_system7_0_FCLK_CLK0 [get_bd_pins PS7/FCLK_CLK0] \
  [get_bd_pins axi_gpio_0/s_axi_aclk] [get_bd_pins axi_gpio_1/s_axi_aclk] [get_bd_pins axi_gpio_2/s_axi_aclk]
connect_bd_net -net rst_ps7_0_125M_peripheral_aresetn [get_bd_pins PS7/S00_ARESETN] \
  [get_bd_pins axi_gpio_0/s_axi_aresetn] [get_bd_pins axi_gpio_1/s_axi_aresetn] [get_bd_pins axi_gpio_2/s_axi_aresetn]
connect_bd_net [get_bd_pins util_ds_buf_1/IBUF_OUT] [get_bd_pins util_ds_buf_2/OBUF_IN]
connect_bd_net [get_bd_pins util_ds_buf_2/OBUF_DS_N] [get_bd_ports daisy_n_o]
connect_bd_net [get_bd_pins util_ds_buf_2/OBUF_DS_P] [get_bd_ports daisy_p_o]
connect_bd_net [get_bd_pins signal_split_0/M_AXIS_PORT1_tdata] [get_bd_pins Amplifier_11/int_in] [get_bd_pins Amplifier_21/int_in]
connect_bd_net [get_bd_pins xlconstant_0/dout] \
  [get_bd_pins adder_axi_0/rstn_i] [get_bd_pins adder_axi_1/rstn_i] [get_bd_pins Amplifier_11/rst] \
  [get_bd_pins Amplifier_22/rst] [get_bd_pins Amplifier_21/rst] [get_bd_pins Amplifier_12/rst]
connect_bd_net [get_bd_pins signal_split_0/M_AXIS_PORT2_tdata] [get_bd_pins Amplifier_12/int_in] [get_bd_pins Amplifier_22/int_in]
connect_bd_net [get_bd_pins axi_gpio_1/gpio_io_o] [get_bd_pins axi_gpio_1/gpio_io_i] [get_bd_pins Amplifier_11/cfg_data]
connect_bd_net [get_bd_pins axi_gpio_1/gpio2_io_o] [get_bd_pins axi_gpio_1/gpio2_io_i] [get_bd_pins Amplifier_12/cfg_data]
connect_bd_net [get_bd_pins axi_gpio_2/gpio_io_o] [get_bd_pins axi_gpio_2/gpio_io_i] [get_bd_pins Amplifier_21/cfg_data]
connect_bd_net [get_bd_pins axi_gpio_2/gpio2_io_o] [get_bd_pins axi_gpio_2/gpio2_io_i] [get_bd_pins Amplifier_22/cfg_data]
connect_bd_net [get_bd_pins FIFO_delay_port1/m_axis_tvalid] [get_bd_pins dac/S_AXIS_PORT1_tvalid]
connect_bd_net [get_bd_pins FIFO_delay_port1/m_axis_tdata] [get_bd_pins dac/S_AXIS_PORT1_tdata]
connect_bd_net [get_bd_pins FIFO_delay_port2/m_axis_tvalid] [get_bd_pins dac/S_AXIS_PORT2_tvalid]
connect_bd_net [get_bd_pins FIFO_delay_port2/m_axis_tdata] [get_bd_pins dac/S_AXIS_PORT2_tdata]

# ---- address map ----
assign_bd_address -offset 0x41200000 -range 4K -target_address_space [get_bd_addr_spaces PS7/processing_system7_0/Data] [get_bd_addr_segs axi_gpio_1/S_AXI/Reg]
assign_bd_address -offset 0x41210000 -range 4K -target_address_space [get_bd_addr_spaces PS7/processing_system7_0/Data] [get_bd_addr_segs axi_gpio_2/S_AXI/Reg]
assign_bd_address -offset 0x42000000 -range 4K -target_address_space [get_bd_addr_spaces PS7/processing_system7_0/Data] [get_bd_addr_segs axi_gpio_0/S_AXI/Reg]

validate_bd_design
save_bd_design
